# Altium schematic sheet main_rtc.SchDoc: SDL - Main
size Letter; Author: Ye-Sheng Kuo; Revision: 1; SheetNumber: 7; SheetTotal: 8
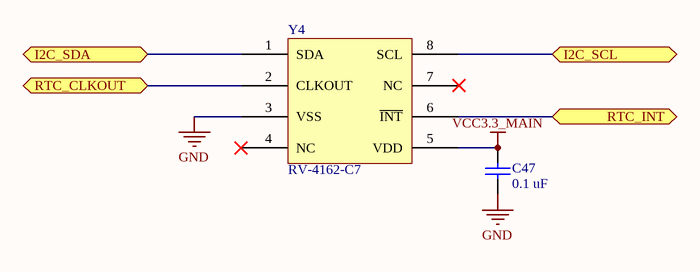
[diagram p0: main_rtc.SchDoc]

## Parts
C47  value 0.1 uF  [0402]  (hidden comment: Ceramic capacitor)
Y4  RV-4162-C7  [RV4162]

## Ports
I2C_SCL, I2C_SDA, RTC_CLKOUT, RTC_INT

## Nets
GND: C47.2 Y4.3(VSS)
VCC3.3_MAIN: C47.1 Y4.5(VDD)
I2C_SCL: Y4.8(SCL) ; port I2C_SCL
I2C_SDA: Y4.1(SDA) ; port I2C_SDA
RTC_CLKOUT: Y4.2(CLKOUT) ; port RTC_CLKOUT
RTC_INT: Y4.6(~{INT}) ; port RTC_INT

Not connected (* = marked no-connect by the designer): Y4 4(NC)* 7(NC)*

## Notes on the sheet
- Title
- Date:
- Author:
- Revision:
- Sheet
- of
- University of Michigan
- File:

## Library data of the parts
C47 = C_0.1u_0402_ceramic: Ceramic capacitor, 0.1u, 0402 package; Manufacture: TDK; voltage rated: 10 V; tolerance: 10%; Supplier 1: Digi-Key; Supplier Part Number 1: 445-1265-1-ND; package: 0402
Y4 = RV-4162-C7: Real Time Clock Module with I2C Bus; Supplier 1: Newark; Supplier Part Number 1: 09X0517